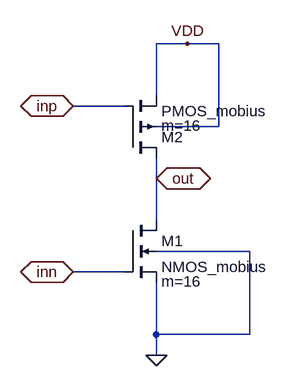
[diagram p0: schematic inverter_A.asc]
inverter_A.asc, the LTspice schematic file:
Version 4
SHEET 1 880 680
WIRE 336 -80 288 -80
WIRE 384 -80 336 -80
WIRE 288 0 288 -80
WIRE 240 16 160 16
WIRE 384 48 384 -80
WIRE 384 48 288 48
WIRE 288 128 288 96
WIRE 288 192 288 128
WIRE 432 240 288 240
WIRE 240 272 160 272
WIRE 288 368 288 288
WIRE 432 368 432 240
WIRE 432 368 288 368
WIRE 288 400 288 368
FLAG 288 128 out
IOPIN 288 128 BiDir
FLAG 160 272 inn
IOPIN 160 272 BiDir
FLAG 288 400 0
FLAG 160 16 inp
IOPIN 160 16 BiDir
FLAG 336 -80 VDD
SYMBOL nmos4 240 192 R0
WINDOW 123 56 94 Left 2
SYMATTR Value2 m=16
SYMATTR InstName M1
SYMATTR Value NMOS_mobius
SYMBOL pmos4 240 96 M180
WINDOW 123 56 50 Left 2
SYMATTR Value2 m=16
SYMATTR InstName M2
SYMATTR Value PMOS_mobius

The netlist it stands for:
* inverter_A.asc
M1 out inn 0 0 NMOS_mobius m=16
M2 out inp VDD VDD PMOS_mobius m=16
.model NMOS NMOS
.model PMOS PMOS
.lib standard.mos
.backanno
.end